# Altium project WCTopping.PrjPcb (part 1 of 2)
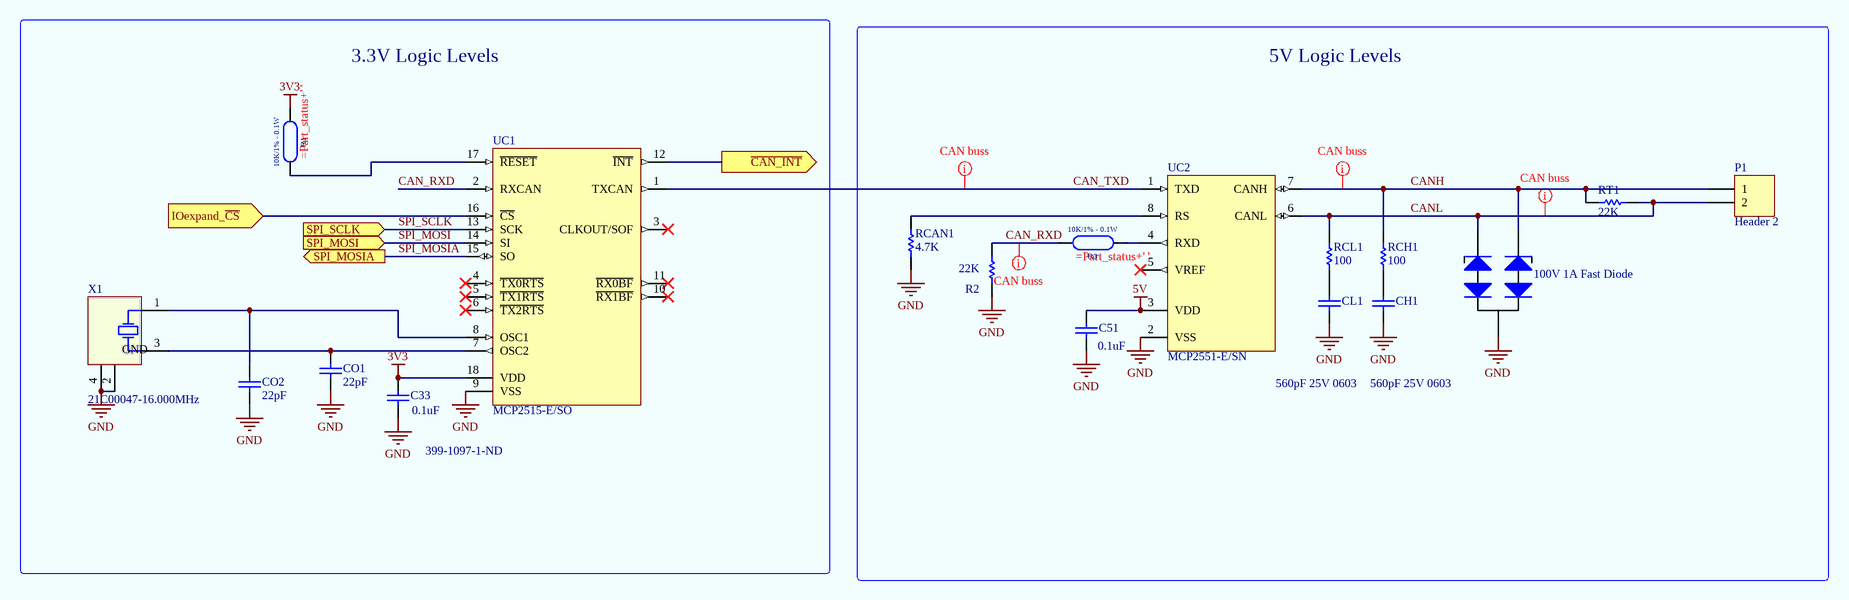
[diagram p0: CAN_Interface.SchDoc]
DrawnBy: TrainingTeam; Project_Name: WC Topping; Revision: 1.2; Title: Altium - Essential Training Example
5 sheets, 56 parts. Net scope: flat (ports and power ports of the same name join across sheets).
Board file: My_PCB.PcbDoc
Sheets:
  CAN_Interface.SchDoc
  Processor_Interface.SchDoc
  Digital_IO.SchDoc
  Relay_IO.SchDoc
  Power Supply.SchDoc

## Sheet CAN_Interface.SchDoc: CAN Bus Interface Logic
size B; Engineer: Daisy Chain; DocumentNumber: 3; Revision: 2.3; SheetNumber: 3; SheetTotal: 5

### Parts
C33  0.1uF  Supplier Part Number 1: 399-1097-1-ND  [0603C_L]
C51  0.1uF  [0603C_L]
CH1  560pF 25V 0603  [0603C_L]
CL1  560pF 25V 0603  [0603C_L]
CO1  22pF  [0603C_L]
CO2  22pF  [0603C_L]
DioCAN1  100V 1A Fast Diode  [SOT23]
P1  Header 2  [HDR1X2]
R1  10K/1% - 0.1W  [R0603]
R2  22K  [0603_L]
R3  10K/1% - 0.1W  [R0603]
RCAN1  4.7K  [0603_L]
RCH1  100  [0603_L]
RCL1  100  [0603_L]
RT1  22K  [0603_L]
UC1  MCP2515-E/SO  [SOIC-SO18_M]
UC2  MCP2551-E/SN  [SOIC-SN8_N]
X1  21C00047-16.000MHz  [ITTI-21C00047-16.000MHz-4_V]

### Blocks framed on the sheet
3.3V Logic Levels: C33 CO1 CO2 R1 UC1 X1
5V Logic Levels: C51 CH1 CL1 DioCAN1 P1 R2 R3 RCAN1 RCH1 RCL1 RT1 UC2

### Ports
IOexpand_~{CS} (in), SPI_MOSI (in), SPI_MOSIA (out), SPI_SCLK (in), ~{CAN_INT} (out)

### Nets
3V3: C33.2 R1.2 UC1.18(VDD)
5V: C51.2 UC2.3(VDD)
GND: C33.1 C51.1 CH1.2 CL1.1 CO1.1 CO2.2 DioCAN1.3 R2.1 RCAN1.1 UC1.9(VSS) UC2.2(VSS) X1.2(GND) X1.4(GND)
CAN_RXD: R2.2 R3.1 UC1.2(RXCAN)
CAN_TXD: UC1.1(TXCAN) UC2.1(TXD)
CANH: DioCAN1.1(A) P1.1 RCH1.2 RT1.2 UC2.7(CANH)
CANL: DioCAN1.2(K) P1.2 RCL1.2 RT1.1 UC2.6(CANL)
GPIO4: UC1.16(~{CS}) ; port IOexpand_~{CS}
GPIO20: UC1.12(~{INT}) ; port ~{CAN_INT}
SPI_MOSI: UC1.14(SI) ; port SPI_MOSI
SPI_MOSIA: UC1.15(SO) ; port SPI_MOSIA
SPI_SCLK: UC1.13(SCK) ; port SPI_SCLK
NetCH1_1: CH1.1 RCH1.1
NetCL1_2: CL1.2 RCL1.1
NetCO1_2: CO1.2 UC1.7(OSC2) X1.3(XTAL)
NetCO2_1: CO2.1 UC1.8(OSC1) X1.1(XTAL)
NetR1_1: R1.1 UC1.17(~{RESET})
NetR3_2: R3.2 UC2.4(RXD)
NetRCAN1_2: RCAN1.2 UC2.8(RS)

Not connected (* = marked no-connect by the designer): UC1 3(CLKOUT/SOF)* 4(~{TX0RTS})* 5(~{TX1RTS})* 6(~{TX2RTS})* 10(~{RX1BF})* 11(~{RX0BF})*; UC2 5(VREF)*

### Layout directives
net class CAN; rule Width Constraint [Pref Width = 20mil    Min Width = 10mil    Max Width = 30mil]; rule Clearance Constraint [Clearance = 20mil]: CAN_RXD, CAN_TXD, CANH, CANL

### Notes on the sheet
- Title
- Size:
- Date:
- B
- Project:
- Time:
- Revision:
- Sheet
- of
- Engineer:
- File:

### Library data of the parts
C33 = Cap10uF_25V_0603: Manufacturer: Kemet; Manufacturer Part Number: C0603C104J4RACTU; Capacitance: 100nF; Tolerance: 5%; Voltage Rating: 16V; Type (Capacitors): X7R; Supplier 1: Digikey; Stock 1: 1096346; Pricing 1: 1=0.11, 10=0.078, 25=0.0572, 50=0.0446, 100=0.0369, 250=0.0305, 500=0.0259, 1000=0.0214 (USD); Mount: Surface Mount; Case/Package: 0603; Pins: 2; Case Code (Metric): 1608; Case Code (Imperial): 0603; Min Operating Temperature: -55°C; Max Operating Temperature: 125°C; Package Quantity: 4000; Packaging: Tape and Reel; Voltage Rating (DC): 16V; Length: 1.6mm; Height: 0.8mm; Width: 0.8mm; Radiation Hardening: No; REACH SVHC: No SVHC; ComponentLink1URL: https://datasheet.ciiva.com/14589/70095383-14589531.pdf; ComponentLink1Description: https://datasheet.ciiva.com/14589/70095383-14589531.pdf; ComponentLink2URL: https://datasheet.ciiva.com/28645/1851736-28645613.pdf; ComponentLink2Description: https://datasheet.ciiva.com/28645/1851736-28645613.pdf; ComponentLink3URL: https://datasheet.ciiva.com/5999/1732731-5999390.pdf; ComponentLink3Description: https://datasheet.ciiva.com/5999/1732731-5999390.pdf; ComponentLink4URL: https://datasheet.ciiva.com/7823/kem-c1002-x7r-smd-7823982.pdf; ComponentLink4Description: https://datasheet.ciiva.com/7823/kem-c1002-x7r-smd-7823982.pdf
C51 = Cap10uF_25V_0603
CH1 CL1 = Cap560pF_25V_0603: Manufacturer: Taiyo Yuden; Manufacturer Part Number: TMK316F106ZL-T; Catalog Drawings: xMK Series_1206_1.6; Capacitance: 10µF; Tolerance: -20%, +80%; Temperature Coefficient: Y5V (F); Online Catalog: M Series; Other Names: 587-1353-6; Supplier 1: Ciiva; Stock 1: 330483; Pricing 1: 1=0.34, 10=0.255, 50=0.1488, 100=0.119, 250=0.085, 500=0.0578, 1000=0.0468 (USD); Standard Package: 1; Category: Capacitors; Family: Ceramic Capacitors; Series: M; Packaging: Digi-Reel®; Voltage - Rated: 25V; Mounting Type: Surface Mount, MLCC; Operating Temperature: -30°C ~ 85°C; Applications: General Purpose; Ratings: -; Package / Case: 1206 (3216 Metric); Size / Dimension: 0.126" L x 0.063" W (3.20mm x 1.60mm); Height - Seated (Max): -; Thickness (Max): 0.071" (1.80mm); Lead Spacing: -; Features: -; Lead Style: -; ComponentLink1URL: https://datasheet.ciiva.com/30217/73tmk316f106zl-t-30217817.pdf; ComponentLink1Description: https://datasheet.ciiva.com/30217/73tmk316f106zl-t-30217817.pdf; ComponentLink2URL: https://datasheet.ciiva.com/11596/tmk316f106zl-t-ss-11596490.pdf; ComponentLink2Description: https://datasheet.ciiva.com/11596/tmk316f106zl-t-ss-11596490.pdf; ComponentLink3URL: https://datasheet.ciiva.com/137/tmk316f106zl-t-ss-137061.pdf; ComponentLink3Description: https://datasheet.ciiva.com/137/tmk316f106zl-t-ss-137061.pdf; ComponentLink4URL: https://datasheet.ciiva.com/15922/1123tmk316f106zl-t-15922467.pdf; ComponentLink4Description: https://datasheet.ciiva.com/15922/1123tmk316f106zl-t-15922467.pdf; ComponentLink5URL: https://datasheet.ciiva.com/7975/746258-7975854.pdf; ComponentLink5Description: https://datasheet.ciiva.com/7975/746258-7975854.pdf; ComponentLink6URL: https://datasheet.ciiva.com/7975/1693457-7975853.pdf; ComponentLink6Description: https://datasheet.ciiva.com/7975/1693457-7975853.pdf; ComponentLink7URL: https://datasheet.ciiva.com/5744/1497285-5744889.pdf; ComponentLink7Description: https://datasheet.ciiva.com/5744/1497285-5744889.pdf; Supplier Part Number 1: 587-1353-1-ND
CO1 = Cap22pF_50V_0603: Manufacturer: Murata; Manufacturer Part Number: GRM1885C1H220JA01D; Capacitance: 22; Voltage Rating: 50; Tolerance: 5; Type (Capacitors): C0G; Supplier 1: Digikey; Supplier Part Number 1: 490-1411-1-ND; Stock 1: 517556; Pricing 1: 1=0.1, 10=0.061, 50=0.0332, 100=0.0281, 250=0.023, 500=0.0196, 1000=0.0153 (USD); Mount: Surface Mount; Case/Package: 0603; Pins: 2; Case Code (Metric): 1608; Case Code (Imperial): 0603; Min Operating Temperature: -55; Max Operating Temperature: 125; Package Quantity: 1; Packaging: Cut Tape; Voltage Rating (DC): 50; Lead Pitch: 4; Length: 1.6; Height: 0.8; Width: 0.8; Radiation Hardening: No; REACH SVHC: No SVHC; ComponentLink1URL: https://datasheet.ciiva.com/131/product-131760.pdf; ComponentLink1Description: https://datasheet.ciiva.com/131/product-131760.pdf; ComponentLink2URL: https://datasheet.ciiva.com/131/partnumbering-e-01-131761.pdf; ComponentLink2Description: https://datasheet.ciiva.com/131/partnumbering-e-01-131761.pdf; ComponentLink3URL: https://datasheet.ciiva.com/14116/grmseries-tc-hitype-eng-14116853.pdf; ComponentLink3Description: https://datasheet.ciiva.com/14116/grmseries-tc-hitype-eng-14116853.pdf; ComponentLink4URL: https://datasheet.ciiva.com/3776/1156grm1885c1h220ja0123-3776984.pdf; ComponentLink4Description: https://datasheet.ciiva.com/3776/1156grm1885c1h220ja0123-3776984.pdf; ComponentLink5URL: https://datasheet.ciiva.com/14116/grmseries-tc-hitype-eng-14116826.pdf; ComponentLink5Description: https://datasheet.ciiva.com/14116/grmseries-tc-hitype-eng-14116826.pdf; ComponentLink6URL: https://datasheet.ciiva.com/11786/0900766b807a1cab-11786398.pdf; ComponentLink6Description: https://datasheet.ciiva.com/11786/0900766b807a1cab-11786398.pdf; ComponentLink7URL: https://datasheet.ciiva.com/131/partnumbering-e-01-131759.pdf; ComponentLink7Description: https://datasheet.ciiva.com/131/partnumbering-e-01-131759.pdf
CO2 = Cap100nF_50V_0603: Manufacturer: Murata; Manufacturer Part Number: GRM1885C1H220JA01D; Capacitance: 22; Voltage Rating: 50; Tolerance: 5; Type (Capacitors): C0G; Supplier 1: Digikey; Supplier Part Number 1: 490-1411-1-ND; Stock 1: 517556; Pricing 1: 1=0.1, 10=0.061, 50=0.0332, 100=0.0281, 250=0.023, 500=0.0196, 1000=0.0153 (USD); Mount: Surface Mount; Case/Package: 0603; Pins: 2; Case Code (Metric): 1608; Case Code (Imperial): 0603; Min Operating Temperature: -55; Max Operating Temperature: 125; Package Quantity: 1; Packaging: Cut Tape; Voltage Rating (DC): 50; Lead Pitch: 4; Length: 1.6; Height: 0.8; Width: 0.8; Radiation Hardening: No; REACH SVHC: No SVHC; ComponentLink1URL: https://datasheet.ciiva.com/131/product-131760.pdf; ComponentLink1Description: https://datasheet.ciiva.com/131/product-131760.pdf; ComponentLink2URL: https://datasheet.ciiva.com/131/partnumbering-e-01-131761.pdf; ComponentLink2Description: https://datasheet.ciiva.com/131/partnumbering-e-01-131761.pdf; ComponentLink3URL: https://datasheet.ciiva.com/14116/grmseries-tc-hitype-eng-14116853.pdf; ComponentLink3Description: https://datasheet.ciiva.com/14116/grmseries-tc-hitype-eng-14116853.pdf; ComponentLink4URL: https://datasheet.ciiva.com/3776/1156grm1885c1h220ja0123-3776984.pdf; ComponentLink4Description: https://datasheet.ciiva.com/3776/1156grm1885c1h220ja0123-3776984.pdf; ComponentLink5URL: https://datasheet.ciiva.com/14116/grmseries-tc-hitype-eng-14116826.pdf; ComponentLink5Description: https://datasheet.ciiva.com/14116/grmseries-tc-hitype-eng-14116826.pdf; ComponentLink6URL: https://datasheet.ciiva.com/11786/0900766b807a1cab-11786398.pdf; ComponentLink6Description: https://datasheet.ciiva.com/11786/0900766b807a1cab-11786398.pdf; ComponentLink7URL: https://datasheet.ciiva.com/131/partnumbering-e-01-131759.pdf; ComponentLink7Description: https://datasheet.ciiva.com/131/partnumbering-e-01-131759.pdf
DioCAN1 = PESD1CAN: High Conductance Fast Diode; Manufacturer: ON Semiconductor; Manufacturer Part Number: MUR110RLG; Diode Case Style: DO-204AL; Diode Configuration: Single; Diode Type: Fast Recovery; Forward Surge Current Ifsm Max: 35A; Forward Voltage VF Max: 1.25V; No. of Pins: 2; Reverse Recovery Time trr Max: 75ns; SVHC: No SVHC (16-Jun-2014)
P1 = Header 2: Header, 2-Pin; LatestRevisionDate: 17-Jul-2002; LatestRevisionNote: Re-released for DXP Platform.; Publisher: Altium Limited
R1 R3 = P_R0603_10K/1%: Resistor 10K ±1% 0.1W 0603; Empresa: 02; GEOMETRY: NO; Part_Name: P_R0603_10K/1%; Codigo: 002.05.107; Value: 10K; Tolerance: ±1%; Mounting: SMT; Power: 0.1W; Supplier 1: Digi-Key; Supplier Part Number 1: 311-10.0KHRTR-ND; ComponentLink1Description: Datasheet; ComponentLink1URL: https://www.yageo.com/upload/media/product/productsearch/datasheet/rchip/PYu-RC_Group_51_RoHS_L_11.pdf; ComponentLink2Description: Manufacturer URL; ComponentLink2URL: https://www.yageo.com/en/Home
R2 RT1 = Res_0603: Manufacturer: Yageo; Manufacturer Part Number: RT0603DRD0722KL; Resistance: 22 kOhms; Tolerance: 0.5 %; Power Rating: 100 mW; Temperature Coefficient: 25 PPM / C; Voltage Rating: 75 V; Unit Weight: 0.000071 oz; Supplier 1: Digikey; Supplier Part Number 1: 311-22KDDKR-ND; Stock 1: 39729; Pricing 1: 1=0.12, 10=0.104, 25=0.0716, 50=0.0558, 100=0.0399, 250=0.0311, 500=0.0247, 1000=0.0175 (USD); Product Category: Thin Film Resistors - SMD; RoHS: True; Case Code - in: 0603; Case Code - mm: 1608; Operating Temperature Range: - 55 C to + 125 C; Series: RT; Packaging: Reel; Brand: Yageo; Height: 0.45 mm; Length: 1.6 mm; Package / Case: 0603 (1608 metric); Product: Thin Film Resistors SMD; Termination Style: SMD/SMT; Type: High Precision, High Stability; Width: 0.8 mm; ComponentLink1URL: https://datasheet.ciiva.com/12810/pyu-rt-1-to-0-05-rohs-l-4-12810773.pdf; ComponentLink1Description: https://datasheet.ciiva.com/12810/pyu-rt-1-to-0-05-rohs-l-4-12810773.pdf
RCAN1 = Res4K99_0603: Manufacturer: Yageo; Manufacturer Part Number: RT0603DRD074K99L; Resistance (Ohms): 4.99k; Tolerance: ±0.5%; Power (Watts): 0.1W, 1/10W; Temperature Coefficient: ±25ppm/°C; Supplier 1: Digi-Key; RoHS: RoHS Compliant; Category: Resistors; Stock 1: 28874; Pricing 1: 1=0.22, 10=0.184, 25=0.134, 100=0.0721, 250=0.05532, 500=0.04358, 1000=0.03018, 2500=0.02766 (USD); Packaging: Cut Tape (CT); Part Status: Active; Composition: Thin Film; Features: Moisture Resistant; Operating Temperature: -55°C ~ 155°C; Package / Case: 0603 (1608 Metric); Supplier Device Package: 0603; Size / Dimension: 0.063" L x 0.031" W (1.60mm x 0.80mm); Height: 0.022" (0.55mm); Number of Terminations: 2; Failure Rate: -; ComponentLink1URL: http://www.yageo.com/documents/recent/PYu-RT_1-to-0.05_RoHS_L_6.pdf; ComponentLink1Description: http://www.yageo.com/documents/recent/PYu-RT_1-to-0.05_RoHS_L_6.pdf; Supplier Part Number 1: 311-4.99KDCT-ND
RCH1 RCL1 = Res330_0603: Manufacturer: Yageo; Manufacturer Part Number: RC0603JR-07330RL; Resistance (Ohms): 330; Tolerance: ±5%; Power (Watts): 0.1W, 1/10W; Temperature Coefficient: ±100ppm/°C; Supplier 1: Digi-Key; RoHS: RoHS Compliant; Category: Resistors; Stock 1: 1303594; Pricing 1: 1=0.1, 10=0.011, 25=0.008, 100=0.0044, 250=0.00336, 500=0.0027, 1000=0.00198, 2500=0.00172 (USD); Packaging: Cut Tape (CT); Part Status: Active; Composition: Thick Film; Features: Moisture Resistant; Operating Temperature: -55°C ~ 155°C; Package / Case: 0603 (1608 Metric); Supplier Device Package: 0603; Size / Dimension: 0.063" L x 0.031" W (1.60mm x 0.80mm); Height: 0.022" (0.55mm); Number of Terminations: 2; Failure Rate: -; ComponentLink1URL: http://www.yageo.com/documents/recent/PYu-RC_Group_51_RoHS_L_04.pdf; ComponentLink1Description: http://www.yageo.com/documents/recent/PYu-RC_Group_51_RoHS_L_04.pdf; Supplier Part Number 1: 311-330GRCT-ND
UC1 = CMP-0186-00035-2: Stand-Alone CAN Controller With SPI Interface, 18-Pin SOIC, Extended Temperature; RevisionNote: URLs added. DatasheetVersion updated.; DatasheetVersion: revF, Oct-2010; ComponentLink2Description: Datasheet; ComponentLink3Description: Package Specification; ComponentLink1Description: Manufacturer URL; PackageReference: SOIC-SO18; PackageDescription: 18-Lead Plastic Small Outline (SO) - Wide 7.50mm Body [SOIC]; PackageVersion: revBB, Aug-2009; ComponentLink1URL: http://www.microchip.com/; ComponentLink3URL: http://www.microchip.com/stellent/groups/techpub_sg/documents/packagingspec/en012702.pdf; ComponentLink2URL: http://ww1.microchip.com/downloads/en/DeviceDoc/21801f.pdf; Code_JEDEC: MS-013
UC2 = CMP-0186-00038-2: High-Speed CAN Transceiver, 8-Pin SOIC, Extended Temperature; PackageReference: SOIC-SN8; Code_JEDEC: MS-012; ComponentLink1Description: Manufacturer URL; ComponentLink1URL: http://www.microchip.com/; PackageVersion: revBB, Aug-2009; ComponentLink3Description: Package Specification; Code_IPC: SOIC127P600-8; ComponentLink2URL: http://ww1.microchip.com/downloads/en/DeviceDoc/21667F.pdf; RevisionNote: URLs added. DatasheetVersion updated.; ComponentLink3URL: http://www.microchip.com/stellent/groups/techpub_sg/documents/packagingspec/en012702.pdf; DatasheetVersion: revF, Jul-2010; ComponentLink2Description: Datasheet; PackageDescription: 8-Lead Plastic Small Outline (SN) - Narrow, 3.90mm Body [SOIC]
X1 = CMP-0464-00001-2: Crystal, 16 MHz, -30 to 85 degC, 3.2 x 2.5 x 0.9 mm SMD; Manufacturer: ITTI; Frequency Tolerance: +/-20 ppm; Load Capacitance: 10 pF; Drive Level: 100 max. uw; Nominal Frequency: 16 MHz; Overtone order: Fundamental; ComponentLink1Description: Manufacturer URL; PackageDescription: 4-Pin Hand Drawn, Body 3.2 x 2.5mm; ComponentLink1URL: http://www.itti-co.com; PartNumber: 21C00047-16.000MHz; Operating temperature: -30 to 85 degC; PackageReference: 21C00047-16.000MHz-4; Mounting Technology: Surface Mount

## Sheet Processor_Interface.SchDoc: Processor 40pin GPIO Interface
size A; Engineer: D Board; DocumentNumber: 1; Revision: 1.2c; SheetNumber: 1; SheetTotal: 5
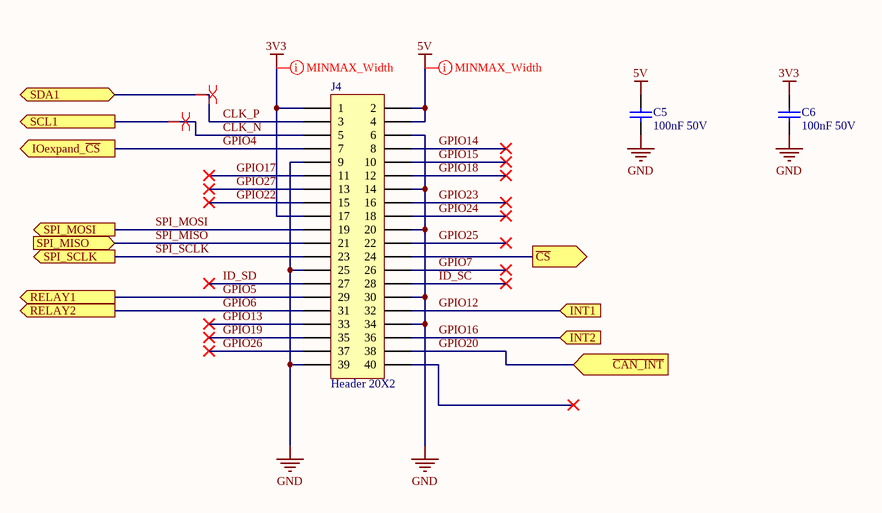
[diagram p1: Processor_Interface.SchDoc]

### Parts
C5  100nF 50V  [0603C_L]
C6  100nF 50V  [0603C_L]
J4  Header 20X2  [HDR2X20]

### Ports
INT1 (in), INT2 (in), IOexpand_~{CS} (out), RELAY1 (out), RELAY2 (out), SCL1 (out), SDA1 (bidir), SPI_MISO (in), SPI_MOSI (out), SPI_SCLK (out), ~{CAN_INT} (in), ~{CS} (out)

### Nets
3V3: C6.2 J4.1 J4.17
5V: C5.2 J4.2 J4.4
GND: C5.1 C6.1 J4.6 J4.9 J4.14 J4.20 J4.25 J4.30 J4.34 J4.39
~{CS}: J4.24 ; port ~{CS}
CLK_N: J4.5 ; port SCL1
CLK_P: J4.3 ; port SDA1
GPIO4: J4.7 ; port IOexpand_~{CS}
GPIO5: J4.29 ; port RELAY1
GPIO6: J4.31 ; port RELAY2
GPIO7: J4.26
GPIO12: J4.32 ; port INT1
GPIO13: J4.33
GPIO14: J4.8
GPIO15: J4.10
GPIO16: J4.36 ; port INT2
GPIO17: J4.11
GPIO18: J4.12
GPIO19: J4.35
GPIO20: J4.38 ; port ~{CAN_INT}
GPIO22: J4.15
GPIO23: J4.16
GPIO24: J4.18
GPIO25: J4.22
GPIO26: J4.37
GPIO27: J4.13
ID_SC: J4.28
ID_SD: J4.27
SPI_MISO: J4.21 ; port SPI_MISO
SPI_MOSI: J4.19 ; port SPI_MOSI
SPI_SCLK: J4.23 ; port SPI_SCLK

Not connected (* = marked no-connect by the designer): J4 40*

### Layout directives
differential pair: CLK_N, CLK_P
rule Width Constraint [Pref Width = 20mil    Min Width = 10mil    Max Width = 30mil]: 3V3, 5V

### Notes on the sheet
- Title
- Size:
- Date:
- A
- Project:
- Time:
- Revision:
- Sheet
- of
- Engineer:
- File:

### Library data of the parts
C5 C6 = Cap100nF_50V_0603: Manufacturer: Yageo; Manufacturer Part Number: CC0603ZRY5V9BB104; Capacitance: 0.10µF; Tolerance: -20%, +80%; Temperature Coefficient: Y5V (F); Supplier 1: Digi-Key; Supplier Part Number 1: 311-1343-1-ND; RoHS: RoHS Compliant; Category: Capacitors; Stock 1: 1827128; Pricing 1: 1=0.1, 10=0.018, 25=0.0128, 100=0.0082, 250=0.00672, 500=0.00574, 1000=0.00447 (USD); Packaging: Cut Tape (CT); Part Status: Active; Voltage - Rated: 50V; Operating Temperature: -30°C ~ 85°C; Features: -; Ratings: -; Applications: General Purpose; Failure Rate: -; Mounting Type: Surface Mount, MLCC; Package / Case: 0603 (1608 Metric); Size / Dimension: 0.063" L x 0.031" W (1.60mm x 0.80mm); Height - Seated (Max): -; Thickness (Max): 0.035" (0.90mm); Lead Spacing: -; Lead Style: -; ComponentLink1URL: http://www.yageo.com/documents/recent/UPY-GPHC_Y5V_6.3V-to-50V_6.pdf; ComponentLink1Description: http://www.yageo.com/documents/recent/UPY-GPHC_Y5V_6.3V-to-50V_6.pdf
J4 = Header 20X2: Header, 20-Pin, Dual row; LatestRevisionDate: 17-Jul-2002; LatestRevisionNote: Re-released for DXP Platform.; Publisher: Altium Limited

## Sheet Digital_IO.SchDoc: Digital IO Expansion Logic
size B; Engineer: Z Transform; DocumentNumber: 2; Revision: 1.1; SheetNumber: 2; SheetTotal: 5
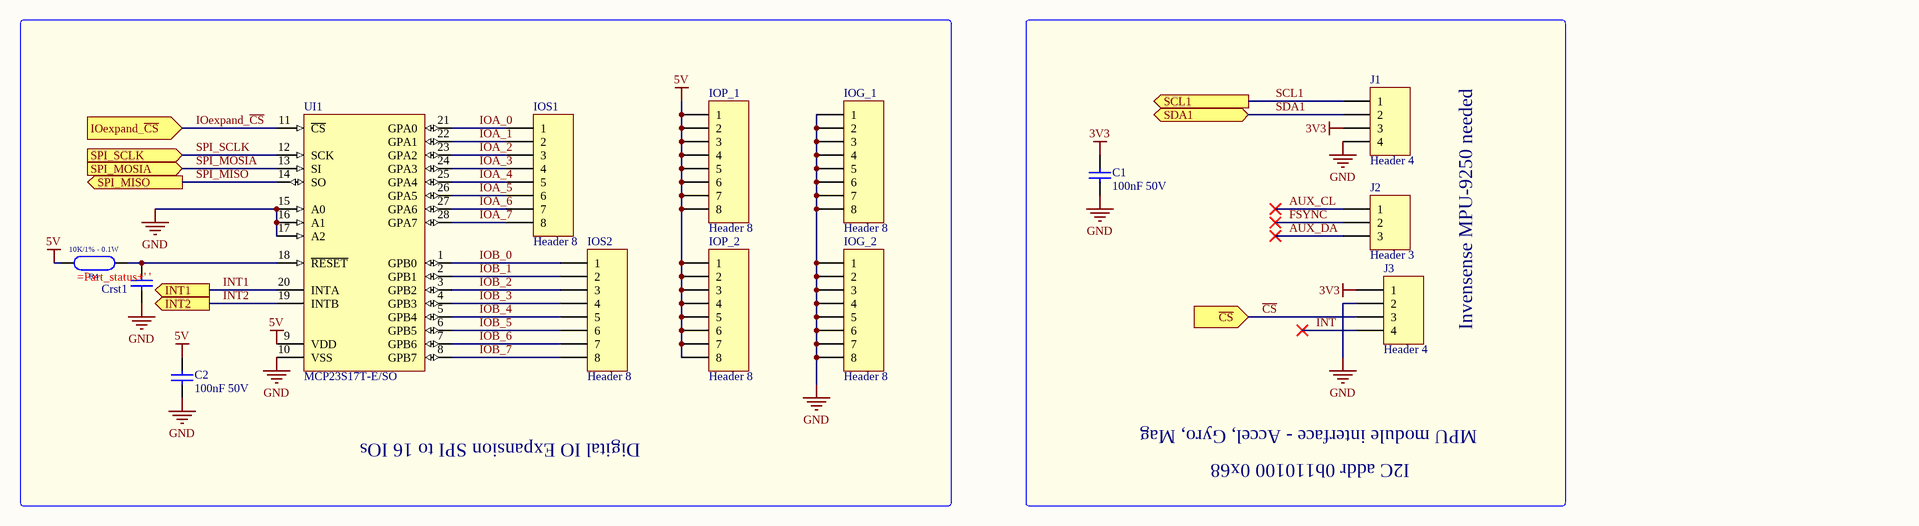
[diagram p2: Digital_IO.SchDoc]

### Parts
C1  100nF 50V  [0603C_L]
C2  100nF 50V  [0603C_L]
Crst1  100nF 50V  [0603C_L]  (value not drawn)
IOG_1  Header 8  [HDR1X8]
IOG_2  Header 8  [HDR1X8]
IOP_1  Header 8  [HDR1X8]
IOP_2  Header 8  [HDR1X8]
IOS1  Header 8  [HDR1X8]
IOS2  Header 8  [HDR1X8]
J1  Header 4  [HDR1X4]
J2  Header 3  [HDR1X3]
J3  Header 4  [HDR1X4]
R4  10K/1% - 0.1W  [R0603]
UI1  MCP23S17T-E/SO  [SOIC-SO28_L]

### Blocks framed on the sheet
Digital IO Expansion SPI to 16 IOs: C2 Crst1 IOG_1 IOG_2 IOP_1 IOP_2 IOS1 IOS2 R4 UI1

### Ports
INT1 (out), INT2 (out), IOexpand_~{CS} (in), SCL1 (out), SDA1 (bidir), SPI_MISO (out), SPI_MOSIA (in), SPI_SCLK (in), ~{CS} (in)

### Nets
3V3: C1.2 J1.3 J3.1
5V: C2.2 IOP_1.1 IOP_1.2 IOP_1.3 IOP_1.4 IOP_1.5 IOP_1.6 IOP_1.7 IOP_1.8 IOP_2.1 IOP_2.2 IOP_2.3 IOP_2.4 IOP_2.5 IOP_2.6 IOP_2.7 IOP_2.8 R4.1 UI1.9(VDD)
GND: C1.1 C2.1 Crst1.1 IOG_1.1 IOG_1.2 IOG_1.3 IOG_1.4 IOG_1.5 IOG_1.6 IOG_1.7 IOG_1.8 IOG_2.1 IOG_2.2 IOG_2.3 IOG_2.4 IOG_2.5 IOG_2.6 IOG_2.7 IOG_2.8 J1.4 J3.2 UI1.10(VSS) UI1.15(A0) UI1.16(A1) UI1.17(A2)
AUX_CL: J2.1
AUX_DA: J2.3
~{CS}: J3.3 ; port ~{CS}
FSYNC: J2.2
INT: J3.4
INT1: UI1.20(INTA) ; port INT1  [project net GPIO12]
INT2: UI1.19(INTB) ; port INT2  [project net GPIO16]
IOA_0: IOS1.1 UI1.21(GPA0)
IOA_1: IOS1.2 UI1.22(GPA1)
IOA_2: IOS1.3 UI1.23(GPA2)
IOA_3: IOS1.4 UI1.24(GPA3)
IOA_4: IOS1.5 UI1.25(GPA4)
IOA_5: IOS1.6 UI1.26(GPA5)
IOA_6: IOS1.7 UI1.27(GPA6)
IOA_7: IOS1.8 UI1.28(GPA7)
IOB_0: IOS2.1 UI1.1(GPB0)
IOB_1: IOS2.2 UI1.2(GPB1)
IOB_2: IOS2.3 UI1.3(GPB2)
IOB_3: IOS2.4 UI1.4(GPB3)
IOB_4: IOS2.5 UI1.5(GPB4)
IOB_5: IOS2.6 UI1.6(GPB5)
IOB_6: IOS2.7 UI1.7(GPB6)
IOB_7: IOS2.8 UI1.8(GPB7)
IOexpand_~{CS}: UI1.11(~{CS}) ; port IOexpand_~{CS}  [project net GPIO4]
SCL1: J1.1 ; port SCL1  [project net CLK_N]
SDA1: J1.2 ; port SDA1  [project net CLK_P]
SPI_MISO: UI1.14(SO) ; port SPI_MISO
SPI_MOSIA: UI1.13(SI) ; port SPI_MOSIA
SPI_SCLK: UI1.12(SCK) ; port SPI_SCLK
NetCrst1_2: Crst1.2 R4.2 UI1.18(~{RESET})

### Notes on the sheet
- Invensense MPU-9250 needed
- MPU module interface - Accel, Gyro, Mag
- I2C addr 0b110100 0x68
- Title
- Size:
- Date:
- B
- Project:
- Time:
- Revision:
- Sheet
- of
- Engineer:
- File:

### Library data of the parts
C1 C2 Crst1 = Cap100nF_50V_0603: as C5 on sheet Processor_Interface; Supplier 1: Digi-Key; Supplier Part Number 1: 311-1343-1-ND; RoHS: RoHS Compliant; Category: Capacitors; Stock 1: 1827128; Pricing 1: 1=0.1, 10=0.018, 25=0.0128, 100=0.0082, 250=0.00672, 500=0.00574, 1000=0.00447 (USD); Packaging: Cut Tape (CT); Part Status: Active; Voltage - Rated: 50V; Operating Temperature: -30°C ~ 85°C; Features: -; Ratings: -; Applications: General Purpose; Failure Rate: -; Mounting Type: Surface Mount, MLCC; Package / Case: 0603 (1608 Metric); Size / Dimension: 0.063" L x 0.031" W (1.60mm x 0.80mm); Height - Seated (Max): -; Thickness (Max): 0.035" (0.90mm); Lead Spacing: -; Lead Style: -; ComponentLink1URL: http://www.yageo.com/documents/recent/UPY-GPHC_Y5V_6.3V-to-50V_6.pdf; ComponentLink1Description: http://www.yageo.com/documents/recent/UPY-GPHC_Y5V_6.3V-to-50V_6.pdf
IOG_1 IOG_2 IOP_1 IOP_2 IOS1 IOS2 = Header 8: Header, 8-Pin; LatestRevisionDate: 17-Jul-2002; LatestRevisionNote: Re-released for DXP Platform.; Publisher: Altium Limited
J1 J3 = Header 4: Header, 4-Pin; LatestRevisionDate: 17-Jul-2002; LatestRevisionNote: Re-released for DXP Platform.; Publisher: Altium Limited
J2 = Header 3: Header, 3-Pin; LatestRevisionDate: 17-Jul-2002; LatestRevisionNote: Re-released for DXP Platform.; Publisher: Altium Limited
R4 = P_R0603_10K/1%: as R1 on sheet CAN_Interface; Part_Name: P_R0603_10K/1%; Codigo: 002.05.107; Value: 10K; Tolerance: ±1%; Mounting: SMT; Power: 0.1W; Supplier 1: Digi-Key; Supplier Part Number 1: 311-10.0KHRTR-ND; ComponentLink1Description: Datasheet; ComponentLink1URL: https://www.yageo.com/upload/media/product/productsearch/datasheet/rchip/PYu-RC_Group_51_RoHS_L_11.pdf; ComponentLink2Description: Manufacturer URL; ComponentLink2URL: https://www.yageo.com/en/Home
UI1 = CMP-0186-00131-2: 16-Bit I/O Expander with Serial Interface, 28-Pin SOIC, Extended Temperature, Tape and Reel; PackageDescription: 28-Lead Plastic Small Outline (SO) - Wide 7.50mm Body [SOIC]; ComponentLink1URL: http://www.microchip.com/; Code_JEDEC: MS-013; ComponentLink3URL: http://www.microchip.com/stellent/groups/techpub_sg/documents/packagingspec/en012702.pdf; DatasheetVersion: revB, Feb-2007; ComponentLink2URL: http://ww1.microchip.com/downloads/en/DeviceDoc/21952b.pdf; ComponentLink2Description: Datasheet; ComponentLink3Description: Package Specification; PackageReference: SOIC-SO28; RevisionNote: URLs added. Sch pin type corrected.; ComponentLink1Description: Manufacturer URL; PackageVersion: revBB, Aug-2009

## Sheet Relay_IO.SchDoc: 12V Solenoid Relay Logic
size A; Engineer: S Circuit; DocumentNumber: 4; Revision: 1.2; SheetNumber: 4; SheetTotal: 5
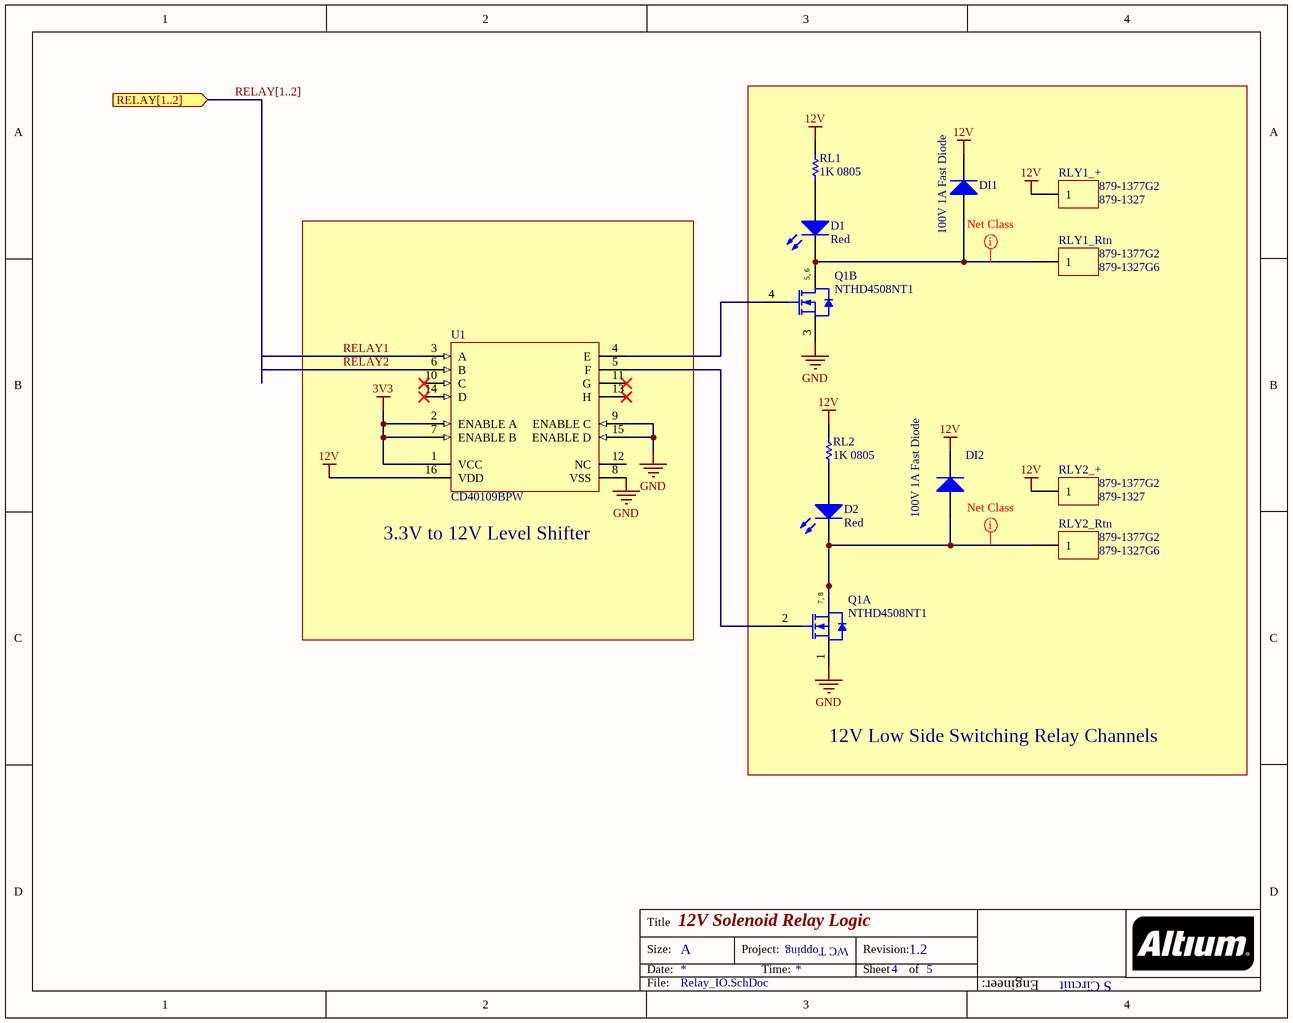
[diagram p3: Relay_IO.SchDoc]

### Parts
D1  Color: Red  [0603_A]  (hidden comment: LED Red)
D2  Color: Red  [0603_A]  (hidden comment: LED Red)
DI1  100V 1A Fast Diode  [DO-35]
DI2  100V 1A Fast Diode  [DO-35]
Q1  NTHD4508NT1  [ONSC-CHIPFET-8-1206A-03_S2_V]  (parts A,B of 2)
RL1  1K 0805  [0805_L]
RL2  1K 0805  [0805_L]
RLY1_+  Supplier Part Number 1: 879-1377G2  Supplier Part Number 2: 879-1327  [Anderson_Red_RHT_BOT]  (hidden comment: Anderson-1Pin RED_PCB_RHT)
RLY1_Rtn  Supplier Part Number 1: 879-1377G2  Supplier Part Number 2: 879-1327G6  [Anderson_BLK_RHT_BOT]  (hidden comment: Anderson-1Pin BLK_PCB_RHT)
RLY2_+  Supplier Part Number 1: 879-1377G2  Supplier Part Number 2: 879-1327  [Anderson_Red_RHT_BOT]  (hidden comment: Anderson-1Pin RED_PCB_RHT)
RLY2_Rtn  Supplier Part Number 1: 879-1377G2  Supplier Part Number 2: 879-1327G6  [Anderson_BLK_RHT_BOT]  (hidden comment: Anderson-1Pin BLK_PCB_RHT)
U1  CD40109BPW  [PW0016A_M]

### Blocks framed on the sheet
12V Low Side Switching Relay Channels: D1 D2 DI1 DI2 Q1 RL1 RL2 RLY1_+ RLY1_Rtn RLY2_+ RLY2_Rtn
3.3V to 12V Level Shifter: U1

### Ports
RELAY[1..2] (in)

### Nets
3V3: U1.1(VCC) U1.2(ENABLE_A) U1.7(ENABLE_B)
12V: DI1.2(K) DI2.2(K) RL1.2 RL2.2 RLY1_+.1 RLY2_+.1 U1.16(VDD)
GND: Q1.1(S1) Q1.3(S2) U1.8(VSS) U1.9(ENABLE_C) U1.15(ENABLE_D)
RELAY1: U1.3(A)
RELAY2: U1.6(B)
NetD1_1: D1.1(K) DI1.1(A) Q1.5(D2) Q1.6(D2) RLY1_Rtn.1
NetD1_2: D1.2(A) RL1.1
NetD2_1: D2.1(K) DI2.1(A) Q1.7(D1) Q1.8(D1) RLY2_Rtn.1
NetD2_2: D2.2(A) RL2.1
NetQ1_2: Q1.2(G1) U1.5(F)
NetQ1_4: Q1.4(G2) U1.4(E)

Not connected (* = marked no-connect by the designer): U1 10(C)* 11(G)* 12(NC) 13(H)* 14(D)*

### Buses and harness runs
bus RELAY[1..2] = port RELAY[1..2]

### Layout directives
net class PowerNets: NetD1_1, NetD2_1

### Notes on the sheet
- Title
- Size:
- Date:
- A
- Project:
- Time:
- Revision:
- Sheet
- of
- Engineer:
- File:
- (in symbol NTHD4508NT1, part A) 7, 8
- (in symbol NTHD4508NT1, part B) 5, 6

### Library data of the parts
D1 D2 = LED_Red0603: SMD mono-color Chip LED, WL-SMCW, Red; Manufacturer: Wurth Electronics Inc; Manufacturer Part Number: 150060RS75000; Lens Color: Colorless; Lens Transparency: Clear; Millicandela Rating: 250mcd; Lens Style/Size: Rectangle with Flat Top, 1.10mm x 0.70mm; Voltage - Forward (Vf) (Typ): 2V; Current - Test: 20mA; Viewing Angle: 140°; Wavelength - Dominant: 625nm; Wavelength - Peak: 630nm; ComponentLink1URL: http://katalog.we-online.de/led/datasheet/150060RS75000.pdf; ComponentLink1Description: http://katalog.we-online.de/led/datasheet/150060RS75000.pdf; Supplier 1: Digi-Key; Supplier Part Number 1: 732-4978-1-ND; RoHS: RoHS Compliant; Category: Optoelectronics; Stock 1: 22059; Pricing 1: 1=0.24, 50=0.21, 100=0.192, 500=0.174, 1000=0.162 (USD); Packaging: Cut Tape (CT); Mounting Type: Surface Mount; Features: -; Package / Case: 0603 (1608 Metric); Supplier Device Package: 0603; Size / Dimension: 1.60mm L x 0.80mm W; Height (Max): 0.80mm
DI1 DI2 = Diode 1N4148: High Conductance Fast Diode; Manufacturer: ON Semiconductor; Manufacturer Part Number: MUR110RLG; Diode Case Style: DO-204AL; Diode Configuration: Single; Diode Type: Fast Recovery; Forward Surge Current Ifsm Max: 35A; Forward Voltage VF Max: 1.25V; No. of Pins: 2; Reverse Recovery Time trr Max: 75ns; SVHC: No SVHC (16-Jun-2014); Supplier 1: Ciiva; Supplier Part Number 1: MUR110RLGOSCT-ND; Stock 1: 22453; Pricing 1: 1=0.48, 10=0.362, 100=0.2254, 500=0.1541, 1000=0.1185 (USD); Forward Current If(AV): 1A; Operating Temperature Max: 175°C; Packaging: Each; Repetitive Reverse Voltage Vrrm Max: 100V; ComponentLink1URL: https://datasheet.ciiva.com/915/mur120-d-915616.pdf; ComponentLink1Description: https://datasheet.ciiva.com/915/mur120-d-915616.pdf; ComponentLink2URL: https://datasheet.ciiva.com/30479/0900766b812212ee-30479481.pdf; ComponentLink2Description: https://datasheet.ciiva.com/30479/0900766b812212ee-30479481.pdf; ComponentLink3URL: https://datasheet.ciiva.com/25950/mur120-d-25950702.pdf; ComponentLink3Description: https://datasheet.ciiva.com/25950/mur120-d-25950702.pdf; ComponentLink4URL: https://datasheet.ciiva.com/16474/mur120-d-16474333.pdf; ComponentLink4Description: https://datasheet.ciiva.com/16474/mur120-d-16474333.pdf; ComponentLink5URL: https://datasheet.ciiva.com/915/mur120-d-915618.pdf; ComponentLink5Description: https://datasheet.ciiva.com/915/mur120-d-915618.pdf; ComponentLink6URL: https://datasheet.ciiva.com/915/mur120-d-915619.pdf; ComponentLink6Description: https://datasheet.ciiva.com/915/mur120-d-915619.pdf; ComponentLink7URL: https://datasheet.ciiva.com/16208/mur120-d-16208137.pdf; ComponentLink7Description: https://datasheet.ciiva.com/16208/mur120-d-16208137.pdf
Q1 = NTHD4508NT1: Power MOSFET, 20 V, 4.1 A, Dual N-Channel, 8-Pin CHIPFET, Tape and Reel; Manufacturer: On Semiconductor; Manufacturer Part Number: NTHD4508NT1G; V(BR)DSS Min (V): 20; VGS(th) Max (V): 1.2; ID Max (A): 4.1; Ciss Typ (pF): 180; Crss Typ (pF): 25; Qrr Typ (nC): 6; Coss Typ (pF): 80; Channel Polarity: N Channel; VGS Max (V): 12; FET Type: 2 N-Channel (Dual); FET Feature: Logic Level Gate; Drain to Source Voltage (Vdss): 20V; Current - Continuous Drain (Id) @ 25°C: 3A; Rds On (Max) @ Id, Vgs: 75 mOhm @ 3.1A, 4.5V; Vgs(th) (Max) @ Id: 1.2V @ 250µA; Gate Charge (Qg) @ Vgs: 4nC @ 4.5V; Input Capacitance (Ciss) @ Vds: 180pF @ 10V; Power - Max: 1.13W; ComponentLink2URL: http://www.onsemi.com/pub_link/Collateral/NTHD4508N-D.PDF; PackageVersion: Rev. E, 10/2004; PackageReference: CHIPFET-8-1206A-03_S2; PartNumber: NTHD4508NT1; Configuration: Dual; PackageDescription: 8-Pin ChipFET, Body 3.025 x 1.625 mm, Pitch 0.635 mm; DatasheetVersion: Rev. 3; ComponentLink3Description: Package Specification; ComponentLink1URL: http://www.onsemi.com/; Package Type: ChipFET-8; ComponentLink2Description: Datasheet; Packing: Tape and Reel; ComponentLink1Description: Manufacturer URL; ComponentLink3URL: http://www.onsemi.com/pub_link/Collateral/NTHC5513-D.PDF; Mounting Technology: Surface Mount; PartId: 1; Supplier 1: Digi-Key; Supplier Part Number 1: NTHD4508NT1GOSCT-ND; RoHS: RoHS Compliant; Category: Discrete Semiconductor Products; Stock 1: 6850; Pricing 1: 1=0.53, 10=0.457, 100=0.3416, 500=0.26832, 1000=0.20685 (USD); Packaging: Cut Tape (CT); Part Status: Active; Operating Temperature: -55°C ~ 150°C (TJ); Mounting Type: Surface Mount; Package / Case: 8-SMD, Flat Lead; Supplier Device Package: ChipFET™
RL1 RL2 = Res1K_0805: Manufacturer: Panasonic Electronic Components; Manufacturer Part Number: ERJ-6GEYJ102V; Tolerance: ±5%; Power (Watts): 0.125W, 1/8W; Temperature Coefficient: ±200ppm/°C; Supplier 1: Digi-Key; RoHS: RoHS Compliant; Category: Resistors; Stock 1: 1669380; Pricing 1: 1=0.1, 50=0.015, 100=0.011, 250=0.0084, 500=0.00674, 1000=0.00496 (USD); Packaging: Cut Tape (CT); Part Status: Active; Resistance (Ohms): 1k; Composition: Thick Film; Features: Automotive AEC-Q200; Operating Temperature: -55°C ~ 155°C; Package / Case: 0805 (2012 Metric); Supplier Device Package: 0805; Size / Dimension: 0.079" L x 0.049" W (2.00mm x 1.25mm); Height: 0.028" (0.70mm); Number of Terminations: 2; Failure Rate: -; ComponentLink1URL: http://industrial.panasonic.com/www-cgi/jvcr13pz.cgi?E+PZ+3+AOA0001+ERJ6GEYJ102V+7+WW; ComponentLink1Description: http://industrial.panasonic.com/www-cgi/jvcr13pz.cgi?E+PZ+3+AOA0001+ERJ6GEYJ102V+7+WW; Supplier Part Number 1: P1.0KACT-ND
RLY1_+ RLY2_+ = Anderson-1Pin RED_PCB_RHT: 1 pin Anderson; Manufacturer: Anderson Power Products (APP); Manufacturer Part Number: 1377G1, 1377G2, 1327-BK,137G6-BK; Number of Positions / Contacts: 1; Voltage Rating: 600 V; Current Rating: 25 A; Mouser: 879-1327G6; Mouser: 879-1327; Mouser: 879-1377G2; Mouser: 879-1377G1; Supplier 1: Mouser; Stock 1: 233; Pricing 1: 1=1.14, 10=1.14, 50=0.947, 100=0.901, 1000=0.777, 10000=0.777 (USD); Termination Style: Solder; Series: PCB Powerpole; Product Type: Contacts; Contact Material: Copper Alloy; Contact Plating: Tin; ComponentLink1URL: http://components.arrow.com/part/dataview/0323_01933244; ComponentLink1Description: http://components.arrow.com/part/dataview/0323_01933244; ComponentLink2URL: http://www.andersonpower.com/files.php?file=CAT-PPMP(4).pdf; ComponentLink2Description: http://www.andersonpower.com/files.php?file=CAT-PPMP(4).pdf
RLY1_Rtn RLY2_Rtn = Anderson-1Pin BLK_PCB_RHT: 1 pin Anderson; Manufacturer: Anderson Power Products (APP); Manufacturer Part Number: 1377G1, 1377G2, 1327-BK,137G6-BK; Number of Positions / Contacts: 1; Voltage Rating: 600 V; Current Rating: 25 A; Mouser: 879-1327G6; Mouser: 879-1327; Mouser: 879-1377G2; Mouser: 879-1377G1; Supplier 1: Mouser; Stock 1: 233; Pricing 1: 1=1.14, 10=1.14, 50=0.947, 100=0.901, 1000=0.777, 10000=0.777 (USD); Termination Style: Solder; Series: PCB Powerpole; Product Type: Contacts; Contact Material: Copper Alloy; Contact Plating: Tin; ComponentLink1URL: http://components.arrow.com/part/dataview/0323_01933244; ComponentLink1Description: http://components.arrow.com/part/dataview/0323_01933244; ComponentLink2URL: http://www.andersonpower.com/files.php?file=CAT-PPMP(4).pdf; ComponentLink2Description: http://www.andersonpower.com/files.php?file=CAT-PPMP(4).pdf
U1 = CMP-1527-00010-2: CMOS Quad Low-to-High Voltage Level Shifter, 3 to 18 V, -55 to 125 degC, 16-Pin TSSOP (PW16), RoHS, Tube; Manufacturer: Texas Instruments; Number of Bits: 4; VSS: 3 to 18 V; Propagation Delay: 240 ns Max.; PackageDescription: 16-Pin Plastic Small Outline Package, Body 5 x 4.4 mm, Pitch 0.65 mm; ComponentLink3URL: http://www.ti.com/lit/ml/mpds361/mpds361.pdf; Package Reference: PW0016A; ComponentLink2URL: http://www.ti.com/lit/ds/symlink/cd40109b.pdf; RoHS: TRUE; ComponentLink1URL: www.ti.com; ComponentLink1Description: Manufacturer URL; PackageVersion: 4040064-4/G; Number of Channels: 4; PartNumber: CD40109BPW; DatasheetVersion: SCHS099B; Number of Outputs: 4; ComponentLink3Description: Package Specification; ComponentLink2Description: Datasheet; Mounting Technology: Surface Mount; Packing: Tube; Temperature Range: -55 to 125 degC

## Sheet Power Supply.SchDoc: Power Supplies: 5V @ 5A; 3.3V @1A
size A; Engineer: H Potential; DocumentNumber: 5; Revision: 3.4; SheetNumber: 5; SheetTotal: 5
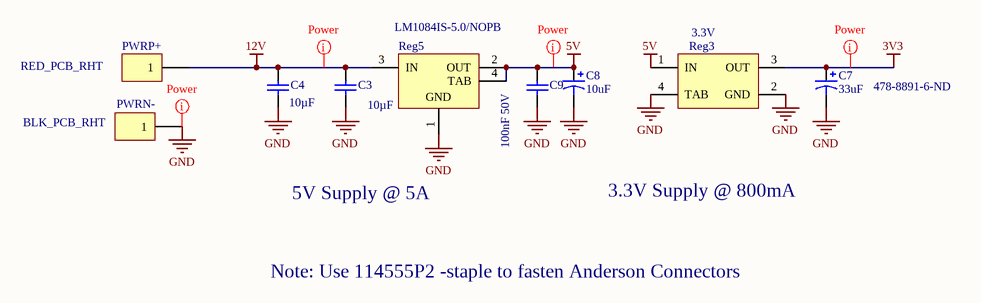
[diagram p4: Power Supply.SchDoc]

### Parts
C3  10µF  [CAPC2013X135X45ML10T25]
C4  10µF  [CAPC2013X135X45ML10T25]
C7  33uF  Supplier Part Number 1: 478-8891-6-ND  [AVX-CAPC3528_V]
C8  10uF  [AVX-CAPC3528_V]
C9  100nF 50V  [0603C_L]
PWRN-  BLK_PCB_RHT  [Anderson_BLK_RHT_BOT]
PWRP+  RED_PCB_RHT  [Anderson_Red_RHT_BOT]
Reg3  3.3V  [DCY0004A_M]
Reg5  LM1084IS-5.0/NOPB  [KTT0003B_L]

### Nets
3V3: C7.1 Reg3.3(OUT)
5V: C8.1 C9.2 Reg3.1(IN) Reg5.2(OUT) Reg5.4(TAB)
12V: C3.2 C4.2 PWRP+.1 Reg5.3(IN)
GND: C3.1 C4.1 C7.2 C8.2 C9.1 PWRN-.1 Reg3.2(GND) Reg3.4(TAB) Reg5.1(GND)

### Layout directives
net class Fonte: 3V3, 5V, 12V, GND

### Notes on the sheet
- 5V Supply @ 5A
- 3.3V Supply @ 800mA
- Note: Use 114555P2 -staple to fasten Anderson Connectors
- Title
- Size:
- Date:
- A
- Project:
- Time:
- Revision:
- Sheet
- of
- Engineer:
- File:

### Library data of the parts
C3 C4 = CMP-2007-03541-1: Part Number: GRM21BR61E106KA73L; Manufacturer: Murata; Product Training Modules: High-Cap Multilayer Ceramic Capacitors; Catalog Drawings: GRM Series_0805_1.25; Tolerance: ±10%; Voltage - Rated: 25V; Temperature Coefficient: X5R; Online Catalog: GRM Series; Other Names: 490-5523-6; Supplier 1: Digikey; Supplier Part Number 1: 490-5523-1-ND; Manufacturer Part Number: GRM21BR61E106KA73L; Stock 1: 750766; Pricing 1: 1=0.19, 10=0.13, 50=0.0748, 100=0.0618, 250=0.052, 500=0.0436, 1000=0.0358 (USD); Standard Package: 1; Category: Capacitors; Family: Ceramic Capacitors; Series: GRM; Packaging: Digi-Reel®; Capacitance: 10µF; Mounting Type: Surface Mount, MLCC; Operating Temperature: -55°C ~ 85°C; Applications: General Purpose; Ratings: -; Package / Case: 0805 (2012 Metric); Size / Dimension: 0.079" L x 0.049" W (2.00mm x 1.25mm); Height - Seated (Max): -; Thickness (Max): 0.053" (1.35mm); Lead Spacing: -; Features: -; Lead Style: -; ComponentLink1URL: https://datasheet.ciiva.com/139/partnumbering-e-01-139184.pdf; ComponentLink1Description: https://datasheet.ciiva.com/139/partnumbering-e-01-139184.pdf; ComponentLink2URL: https://datasheet.ciiva.com/28584/626718-28584288.pdf; ComponentLink2Description: https://datasheet.ciiva.com/28584/626718-28584288.pdf; ComponentLink3URL: https://datasheet.ciiva.com/16440/grm21br61e106ka73l-16440627.pdf; ComponentLink3Description: https://datasheet.ciiva.com/16440/grm21br61e106ka73l-16440627.pdf; ComponentLink4URL: https://datasheet.ciiva.com/7719/1747469-7719093.pdf; ComponentLink4Description: https://datasheet.ciiva.com/7719/1747469-7719093.pdf; ComponentLink5URL: https://datasheet.ciiva.com/5424/product-5424327.pdf; ComponentLink5Description: https://datasheet.ciiva.com/5424/product-5424327.pdf; ComponentLink6URL: https://datasheet.ciiva.com/28584/626718-28584279.pdf; ComponentLink6Description: https://datasheet.ciiva.com/28584/626718-28584279.pdf; ComponentLink7URL: https://datasheet.ciiva.com/14116/grmseries-highdielectrictype-eng-14116376.pdf; ComponentLink7Description: https://datasheet.ciiva.com/14116/grmseries-highdielectrictype-eng-14116376.pdf; ComponentLink8URL: https://datasheet.ciiva.com/22774/1747469-22774396.pdf; ComponentLink8Description: https://datasheet.ciiva.com/22774/1747469-22774396.pdf; ComponentLink9URL: https://datasheet.ciiva.com/139/partnumbering-e-01-139182.pdf; ComponentLink9Description: https://datasheet.ciiva.com/139/partnumbering-e-01-139182.pdf; ComponentLink10URL: https://datasheet.ciiva.com/139/partnumbering-e-01-139183.pdf; ComponentLink10Description: https://datasheet.ciiva.com/139/partnumbering-e-01-139183.pdf; ComponentLink11URL: https://datasheet.ciiva.com/29199/454623-da-01-en-vs-kondensator-0805-29199615.pdf; ComponentLink11Description: https://datasheet.ciiva.com/29199/454623-da-01-en-vs-kondensator-0805-29199615.pdf
C7 = CMP-0279-00001-1: Capacitor, Tantalum, 10uF 10% 20V MCCT-B (3528); Manufacturer: Kyocera / AVX; Manufacturer Part Number: TAJB336K006RNJ; PCN Part Number: TAJ Series Suffix 08/Dec/2008; Manufacturer Size Code: B; Product Training Modules: Component Solutions for Smart Meter Applications; Catalog Drawings: TAJ Series Side / TAJ Series; Voltage - Rated: 6.3V; Type: Molded; Dynamic Catalog: TAJ Series; Other Names: 478-8891-6; Capacitance: 33uF; Supplier 1: Digikey; Stock 1: 0; Pricing 1: 1=0.67, 10=0.476, 25=0.4064, 50=0.36, 100=0.3136, 250=0.2671, 500=0.2323, 1000=0.1974 (USD); Failure Rate: General Purpose; Standard Package: 1; Category: Capacitors; Family: Tantalum Capacitors; Series: TAJ; Packaging: Digi-Reel®; Tolerance: ±10%; ESR (Equivalent Series Resistance): -; Operating Temperature: -55°C ~ 125°C; Mounting Type: Surface Mount; Package / Case: 1210 (3528 Metric); Size / Dimension: 0.138" L x 0.110" W (3.50mm x 2.80mm); Height - Seated (Max): 0.083" (2.10mm); Lead Spacing: -; Features: General Purpose; Lifetime @ Temp.: -; ComponentLink1URL: https://datasheet.ciiva.com/11793/0900766b80ccdc61-11793299.pdf; ComponentLink1Description: https://datasheet.ciiva.com/11793/0900766b80ccdc61-11793299.pdf; ComponentLink2URL: https://datasheet.ciiva.com/7775/1680476-7775701.pdf; ComponentLink2Description: https://datasheet.ciiva.com/7775/1680476-7775701.pdf; ComponentLink3URL: https://datasheet.ciiva.com/7775/1680476-7775702.pdf; ComponentLink3Description: https://datasheet.ciiva.com/7775/1680476-7775702.pdf; ComponentLink4URL: https://datasheet.ciiva.com/7775/1680476-7775703.pdf; ComponentLink4Description: https://datasheet.ciiva.com/7775/1680476-7775703.pdf; ComponentLink5URL: https://datasheet.ciiva.com/28516/taj-28516106.pdf; ComponentLink5Description: https://datasheet.ciiva.com/28516/taj-28516106.pdf; ComponentLink6URL: https://datasheet.ciiva.com/12884/taj-27497-12884571.pdf; ComponentLink6Description: https://datasheet.ciiva.com/12884/taj-27497-12884571.pdf; ComponentLink7URL: https://datasheet.ciiva.com/29504/taj-29504347.pdf; ComponentLink7Description: https://datasheet.ciiva.com/29504/taj-29504347.pdf; ComponentLink8URL: https://datasheet.ciiva.com/29504/taj-29504348.pdf; ComponentLink8Description: https://datasheet.ciiva.com/29504/taj-29504348.pdf; ComponentLink9URL: https://datasheet.ciiva.com/29504/taj-29504349.pdf; ComponentLink9Description: https://datasheet.ciiva.com/29504/taj-29504349.pdf; ComponentLink10URL: https://datasheet.ciiva.com/16492/taj-16492862.pdf; ComponentLink10Description: https://datasheet.ciiva.com/16492/taj-16492862.pdf
C8 = CMP-0279-00001-1: Capacitor, Tantalum, 10uF 10% 20V MCCT-B (3528); PartNumber: TAJB106K020R; Manufacturer: AVX; Manufacturer Part Number: TAJB106K020RNJ; Polarity: Polarized; Case Style: Molded; DCL: 2 uA; DF: 6%; ESR: 2.1 ohm; Insulation: Not Required; Lead Spacing (nom): Not Required mm; Product Depth (mm): 2.8 mm; Product Height (mm): 1.9 mm; Product Length (mm): 3.5 mm; Rad Hardened: No; Voltage: 20VDC; PackageDescription: 2-Pin SMT Capacitor, 3.5 x 2.8 mm Body; ComponentLink1URL: http://www.avx.com/; PackageReference: CAPC3528; ComponentLink2Description: Datasheet; Capacitance: 10uF; Technology: Tantalum; ComponentLink2URL: http://www.avx.com/docs/Catalogs/taj.pdf; Tolerance: 10%; ComponentLink1Description: Manufacturer URL; Rated Voltage: 20V; DatasheetVersion: Jun-13; Mounting Technology: Surface Mount; Supplier 1: Digikey; Supplier Part Number 1: 478-1674-6-ND; Stock 1: 65037; Pricing 1: 1=0.65, 10=0.459, 25=0.392, 50=0.3472, 100=0.3024, 250=0.2576, 500=0.224, 1000=0.1904 (USD); Case Code: B; Construction: SMT Chip; Failure Rate: Not Required; Length W/Weld: Not Required mm; Length W/Weld (max): Not Required mm; Mounting Style: Surface Mount; Operating Temp Range: -55C to 125C; Package / Case: 3528-21; Packaging: Tape and Reel; Product Diameter (mm): Not Required mm; Seal: Not Required; Seated Plane Height: Not Required mm; Tolerance (+ or -): 10%; Wire Form: Not Required; ComponentLink3URL: https://datasheet.ciiva.com/11793/0900766b80ccdc61-11793072.pdf; ComponentLink3Description: https://datasheet.ciiva.com/11793/0900766b80ccdc61-11793072.pdf; ComponentLink4URL: https://datasheet.ciiva.com/14586/70001050-14586940.pdf; ComponentLink4Description: https://datasheet.ciiva.com/14586/70001050-14586940.pdf; ComponentLink5URL: https://datasheet.ciiva.com/16485/taj-16485899.pdf; ComponentLink5Description: https://datasheet.ciiva.com/16485/taj-16485899.pdf; ComponentLink6URL: https://datasheet.ciiva.com/5936/13070-5936843.pdf; ComponentLink6Description: https://datasheet.ciiva.com/5936/13070-5936843.pdf; ComponentLink7URL: https://datasheet.ciiva.com/3004/taj-3004427.pdf; ComponentLink7Description: https://datasheet.ciiva.com/3004/taj-3004427.pdf; ComponentLink8URL: https://datasheet.ciiva.com/16393/taj-16393850.pdf; ComponentLink8Description: https://datasheet.ciiva.com/16393/taj-16393850.pdf; ComponentLink9URL: https://datasheet.ciiva.com/3004/taj-3004426.pdf; ComponentLink9Description: https://datasheet.ciiva.com/3004/taj-3004426.pdf; ComponentLink10URL: https://datasheet.ciiva.com/18710/taj-eng-18710633.pdf; ComponentLink10Description: https://datasheet.ciiva.com/18710/taj-eng-18710633.pdf; ComponentLink11URL: https://datasheet.ciiva.com/12882/taj-27497-12882702.pdf; ComponentLink11Description: https://datasheet.ciiva.com/12882/taj-27497-12882702.pdf; ComponentLink12URL: https://datasheet.ciiva.com/7730/1826076-7730729.pdf; ComponentLink12Description: https://datasheet.ciiva.com/7730/1826076-7730729.pdf; ComponentLink13URL: https://datasheet.ciiva.com/14602/70001050-14602487.pdf; ComponentLink13Description: https://datasheet.ciiva.com/14602/70001050-14602487.pdf; ComponentLink14URL: https://datasheet.ciiva.com/7730/1826076-7730727.pdf; ComponentLink14Description: https://datasheet.ciiva.com/7730/1826076-7730727.pdf; ComponentLink15URL: https://datasheet.ciiva.com/26341/559425-da-01-en-tacc-b-3-2-mm-x-2-5-mm-x-1-9-mm-10-uf-26341766.pdf; ComponentLink15Description: https://datasheet.ciiva.com/26341/559425-da-01-en-tacc-b-3-2-mm-x-2-5-mm-x-1-9-mm-10-uf-26341766.pdf; ComponentLink16URL: https://datasheet.ciiva.com/7730/1826076-7730726.pdf; ComponentLink16Description: https://datasheet.ciiva.com/7730/1826076-7730726.pdf; ComponentLink17URL: https://datasheet.ciiva.com/263/taj-263492.pdf; ComponentLink17Description: https://datasheet.ciiva.com/263/taj-263492.pdf; ComponentLink18URL: https://datasheet.ciiva.com/263/taj-263491.pdf; ComponentLink18Description: https://datasheet.ciiva.com/263/taj-263491.pdf; ComponentLink19URL: https://datasheet.ciiva.com/263/taj-263490.pdf; ComponentLink19Description: https://datasheet.ciiva.com/263/taj-263490.pdf; ComponentLink20URL: https://datasheet.ciiva.com/7730/1826076-7730728.pdf; ComponentLink20Description: https://datasheet.ciiva.com/7730/1826076-7730728.pdf; ComponentLink21URL: https://datasheet.ciiva.com/26787/tajb106k020rnj-26787086.pdf; ComponentLink21Description: https://datasheet.ciiva.com/26787/tajb106k020rnj-26787086.pdf
C9 = Cap100nF_50V_0603: as C5 on sheet Processor_Interface; Supplier 1: Digi-Key; Supplier Part Number 1: 311-1343-1-ND; RoHS: RoHS Compliant; Category: Capacitors; Stock 1: 1827128; Pricing 1: 1=0.1, 10=0.018, 25=0.0128, 100=0.0082, 250=0.00672, 500=0.00574, 1000=0.00447 (USD); Packaging: Cut Tape (CT); Part Status: Active; Voltage - Rated: 50V; Operating Temperature: -30°C ~ 85°C; Features: -; Ratings: -; Applications: General Purpose; Failure Rate: -; Mounting Type: Surface Mount, MLCC; Package / Case: 0603 (1608 Metric); Size / Dimension: 0.063" L x 0.031" W (1.60mm x 0.80mm); Height - Seated (Max): -; Thickness (Max): 0.035" (0.90mm); Lead Spacing: -; Lead Style: -; ComponentLink1URL: http://www.yageo.com/documents/recent/UPY-GPHC_Y5V_6.3V-to-50V_6.pdf; ComponentLink1Description: http://www.yageo.com/documents/recent/UPY-GPHC_Y5V_6.3V-to-50V_6.pdf
PWRN- = Anderson-1Pin BLK_PCB_RHT: as RLY1_Rtn on sheet Relay_IO; Mouser: 879-1327G6; Mouser: 879-1327; Mouser: 879-1377G2; Mouser: 879-1377G1; Supplier 1: Mouser; Stock 1: 233; Pricing 1: 1=1.14, 10=1.14, 50=0.947, 100=0.901, 1000=0.777, 10000=0.777 (USD); Termination Style: Solder; Series: PCB Powerpole; Product Type: Contacts; Contact Material: Copper Alloy; Contact Plating: Tin; ComponentLink1URL: http://components.arrow.com/part/dataview/0323_01933244; ComponentLink1Description: http://components.arrow.com/part/dataview/0323_01933244; ComponentLink2URL: http://www.andersonpower.com/files.php?file=CAT-PPMP(4).pdf; ComponentLink2Description: http://www.andersonpower.com/files.php?file=CAT-PPMP(4).pdf; Supplier Part Number 2: 879-1377G2; Supplier Part Number 1: 879-1377G1; Supplier Part Number 3: 879-1327G6; Supplier Part Number 4: 879-1327
PWRP+ = Anderson-1Pin RED_PCB_RHT: as RLY1_+ on sheet Relay_IO; Mouser: 879-1327G6; Mouser: 879-1327; Mouser: 879-1377G2; Mouser: 879-1377G1; Supplier 1: Mouser; Stock 1: 233; Pricing 1: 1=1.14, 10=1.14, 50=0.947, 100=0.901, 1000=0.777, 10000=0.777 (USD); Termination Style: Solder; Series: PCB Powerpole; Product Type: Contacts; Contact Material: Copper Alloy; Contact Plating: Tin; ComponentLink1URL: http://components.arrow.com/part/dataview/0323_01933244; ComponentLink1Description: http://components.arrow.com/part/dataview/0323_01933244; ComponentLink2URL: http://www.andersonpower.com/files.php?file=CAT-PPMP(4).pdf; ComponentLink2Description: http://www.andersonpower.com/files.php?file=CAT-PPMP(4).pdf; Supplier Part Number 2: 879-1377G2; Supplier Part Number 1: 879-1377G1; Supplier Part Number 3: 879-1327G6; Supplier Part Number 4: 879-1327
Reg3 = CMP-0062-01788-3: 1A Low Dropout Regulator for 5V to 3.3V Conversion, 4-pin SOT-223, Pb-Free; Manufacturer: Texas Instruments; Manufacturer Part Number: LM3940IMP-3.3/NOPB; PowerWise: N; CompType: LDO IC; PackageTopMarking: XYTT*L52B; Voltage Regulator Type: LDO; Regulator Output Type: Fixed; Polarity Type: Positive; Number of Outputs: 1; Input Voltage (Min): 4.5V; Input Voltage: 7.5V; Load Regulation: 50mV; Line Regulation: 40mV; Dropout Voltage@Current (Typ): 0.5@1A/0.11@100mA; Quiescent Current (Max): 15mA; PackageDescription: Molded SOT-223, 6.50 x 3.56 x 1.6mm Body, 4 Lead, 2.3mm Pitch; ComponentLink1URL: http://www.ti.com/general/docs/lit/getliterature.tsp?genericPartNumber=LM3940&fileType=pdf; PackageReference: DCY0004A; RoHS: Y; ComponentLink1Description: Datasheet URL; PinCount: 4; Code_JEDEC: TO-261-AA; Code_IPC: SOT223-4; Supplier 1: Digikey; Supplier Part Number 1: LM3940IMP-3.3/NOPBDKR-ND; Stock 1: 22816; Pricing 1: 1=1.49, 10=1.332, 100=1.0381, 500=0.8585 (USD); Topology: LDO; Output Voltage: 3.3V; Package Type: SOT-223; Packaging: Tape and Reel; Output Current: 1A; Operating Temp Range: -40C to 125C; Operating Temperature Classification: Automotive; Pin Count: 3 +Tab; Mounting: Surface Mount; ComponentLink2URL: https://datasheet.ciiva.com/48433/elnatsemico-spanungsregler-ldo-lm3940-en-48433415.pdf; ComponentLink2Description: https://datasheet.ciiva.com/48433/elnatsemico-spanungsregler-ldo-lm3940-en-48433415.pdf; ComponentLink3URL: https://datasheet.ciiva.com/49046/1896170-49046286.pdf; ComponentLink3Description: https://datasheet.ciiva.com/49046/1896170-49046286.pdf; ComponentLink4URL: https://datasheet.ciiva.com/46384/1882650-46384431.pdf; ComponentLink4Description: https://datasheet.ciiva.com/46384/1882650-46384431.pdf
Reg5 = CMP-0062-00575-4: 5A Low Dropout Positive Regulators, 3-pin TO-263, Pb-Free; Manufacturer: Texas Instruments; PowerWise: N; PackageTopMarking: NSUZXYTTE#*LM1084*IS-5.0; High-Reliability: Y; CompType: LDO IC; ComponentLink1Description: Datasheet URL; PackageDescription: TO-263, Molded, .400 x .390 x .180in, 3 Lead, .1in Pitch, Surface Mount; RoHS: Y; PackageReference: KTT0003B; PinCount: 3; Code_JEDEC: MO-169-AA; PartNumber: LM1084IS-5.0/NOPB; ComponentLink1URL: http://www.ti.com/general/docs/lit/getliterature.tsp?genericPartNumber=LM1084&fileType=pdf